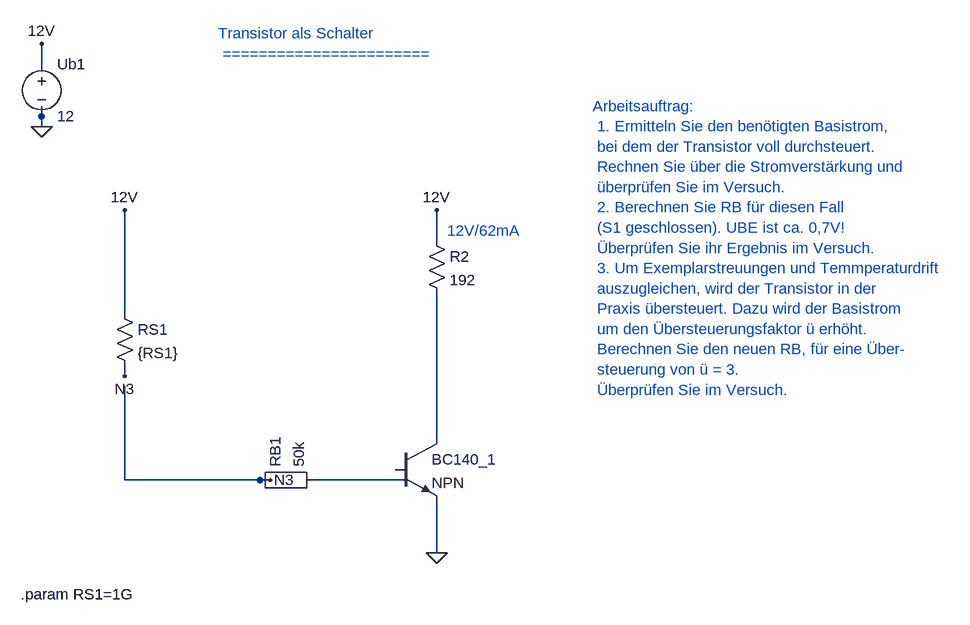
[diagram p0: schematic 5_9_1_Schalten_mit_Transistor.asc]
5_9_1_Schalten_mit_Transistor.asc, the LTspice schematic file:
Version 4
SHEET 1 880 680
WIRE 704 496 704 512
WIRE 96 224 96 208
WIRE 640 768 656 768
WIRE 656 768 656 784
WIRE 704 816 704 848
WIRE 96 240 96 208
WIRE 704 368 704 416
WIRE 432 784 224 784
WIRE 224 784 224 640
WIRE 96 144 96 112
WIRE 224 528 224 368
WIRE 704 720 704 512
WIRE 704 848 704 896
WIRE 656 784 512 784
WIRE 432 784 448 784
WIRE 224 608 224 624
FLAG 704 896 0
FLAG 96 240 0
FLAG 704 896 0
FLAG 96 240 0
FLAG 96 112 12V
FLAG 704 368 12V
FLAG 224 368 12V
FLAG 448 784 N3
FLAG 224 624 N3
SYMBOL res 688 400 R0
SYMATTR InstName R2
SYMATTR Value 192
SYMBOL Misc\EuropeanResistor 416 800 R270
SYMATTR InstName RB1
SYMATTR Value 50k
SYMBOL voltage 96 128 R0
SYMATTR InstName Ub1
SYMATTR Value 12
SYMBOL res 208 512 R0
SYMATTR InstName RS1
SYMATTR Value {RS1}
SYMBOL npn 640 720 R0
SYMATTR InstName BC140_1
SYMATTR Value NPN
TEXT 64 960 Left 2 !.param RS1=1G
TEXT 720 400 Left 2 ;12V/62mA
TEXT 368 96 Left 2 ;Transistor als Schalter \n =======================
TEXT 944 208 Left 2 ;Arbeitsauftrag: \n 1. Ermitteln Sie den benötigten Basistrom, \n bei dem der Transistor voll durchsteuert. \n Rechnen Sie über die Stromverstärkung und \n überprüfen Sie im Versuch. \n 2. Berechnen Sie RB für diesen Fall \n (S1 geschlossen). UBE ist ca. 0,7V! \n Überprüfen Sie ihr Ergebnis im Versuch. \n 3. Um Exemplarstreuungen und Temmperaturdrift \n auszugleichen, wird der Transistor in der \n Praxis übersteuert. Dazu wird der Basistrom \n um den Übersteuerungsfaktor ü erhöht. \n Berechnen Sie den neuen RB, für eine Über- \n steuerung von ü = 3. \n Überprüfen Sie im Versuch.

The netlist it stands for:
* 5_9_1_Schalten_mit_Transistor.asc
R2 12V N001 192
RB1 N3 N002 50k
V§Ub1 12V 0 12
RS1 12V N3 {RS1}
Q§BC140_1 N001 N002 0 0 NPN
.model NPN NPN
.model PNP PNP
.lib standard.bjt
.param RS1=1G
* 12V/62mA
* Transistor als Schalter
*  =======================
* Arbeitsauftrag:
*  1. Ermitteln Sie den benötigten Basistrom,
*  bei dem der Transistor voll durchsteuert.
*  Rechnen Sie über die Stromverstärkung und
*  überprüfen Sie im Versuch.
*  2. Berechnen Sie RB für diesen Fall
*  (S1 geschlossen). UBE ist ca. 0,7V!
*  Überprüfen Sie ihr Ergebnis im Versuch.
*  3. Um Exemplarstreuungen und Temmperaturdrift
*  auszugleichen, wird der Transistor in der
*  Praxis übersteuert. Dazu wird der Basistrom
*  um den Übersteuerungsfaktor ü erhöht.
*  Berechnen Sie den neuen RB, für eine Über-
*  steuerung von ü = 3.
*  Überprüfen Sie im Versuch.
.backanno
.end